# EAGLE design LittleWire_ss (EAGLE 5.11)
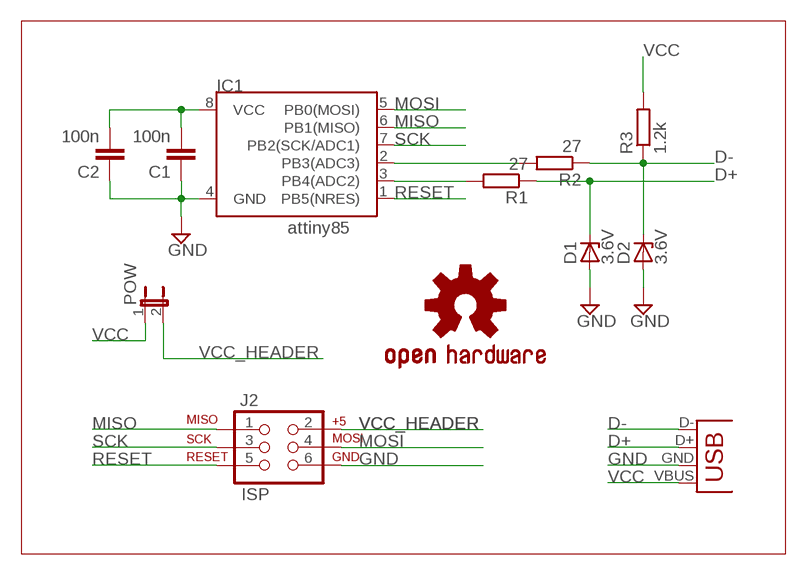
[diagram p0: schematic, sheet 1]

## Parts
C1  100n  C-EU050-025X075  [C050-025X075]
C2  100n  C-EU050-025X075  [C050-025X075]
D1  3.6V  ZENER-DIODEZD-7.5  [ZDIO-7.5]
D2  3.6V  ZENER-DIODEZD-7.5  [ZDIO-7.5]
IC1  ATTINY45DIP8  [DIP08]
J2  ISP  AVR_SPI_PRG_6PTH  [2X3]
POW  JP1E  [JP1]
R1  27  R-EU_0207/7  [0207/7]
R2  27  R-EU_0207/7  [0207/7]
R3  1.2k  R-EU_0207/7  [0207/7]
U$1  OSHW-LOGOS  [OSHW-LOGO-S]
X1  USB-A-H  [USB-A-H]

## Nets
D+: D1.C R1.1 X1.D+(D-)
D-: D2.C R2.1 R3.1 X1.D-(D+)
GND: C1.1 C2.1 D1.A D2.A IC1.4(GND) J2.6 X1.GND(VBUS)
MISO: IC1.6(PB1(MISO)) J2.1
MOSI: IC1.5(PB0(MOSI)) J2.4
N$1: IC1.2(PB3(ADC3)) R2.2
N$2: IC1.3(PB4(ADC2)) R1.2
RESET: IC1.1(PB5(NRES)) J2.5
SCK: IC1.7(PB2(SCK/ADC1)) J2.3
VCC: C1.2 C2.2 IC1.8(VCC) POW.1 R3.2 X1.VBUS(GND)
VCC_HEADER: J2.2 POW.2

## Notes on the sheet
- attiny85

## Library data of the parts
C1 C2 = rcl:C-EU: CAPACITOR, European symbol
D1 D2 = diode:ZENER-DIODE: Z-Diode
IC1 = SparkFun:ATTINY45: Atmel ATTiny45
J2 = SparkFun:AVR_SPI_PRG_6: AVR ISP 6 Pin This is the reduced ISP connector for AVR programming. Common on Arduino. This footprint will take up less PCB space and can be used with a 10-pin to 6-pin adapter such as SKU: BOB-08508
POW = jumper:JP1E: JUMPER
R1-R3 = rcl:R-EU_: RESISTOR, European symbol
U$1 = SparkFun:OSHW-LOGO: Open Source Hardware Logo This logo indicates the piece of hardware it is found on incorporates a OSHW license and/or adheres to the definition of open source hardware found here: http://freedomdefined.org/OSHW
X1 = SparkFun:USB: USB Connectors USB-B-PTH is fully proven SKU : PRT-00139 USB-miniB is fully proven SKU : PRT-00587 USB-A-PCB is untested. USB-A-H is throughly reviewed, but untested. Spark Fun Electronics SKU : PRT-00437 USB-B-SMT is throughly reviewed, but untested. Needs silkscreen touching up. USB-A-S has not been used/tested USB-MB-H has not been used/tested

## Board
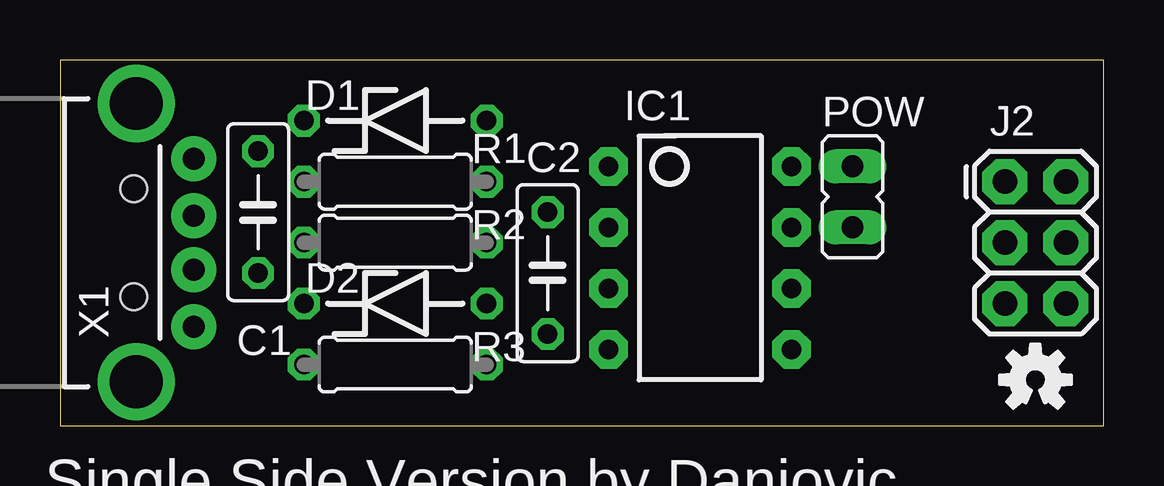
[diagram p1: board, top side]
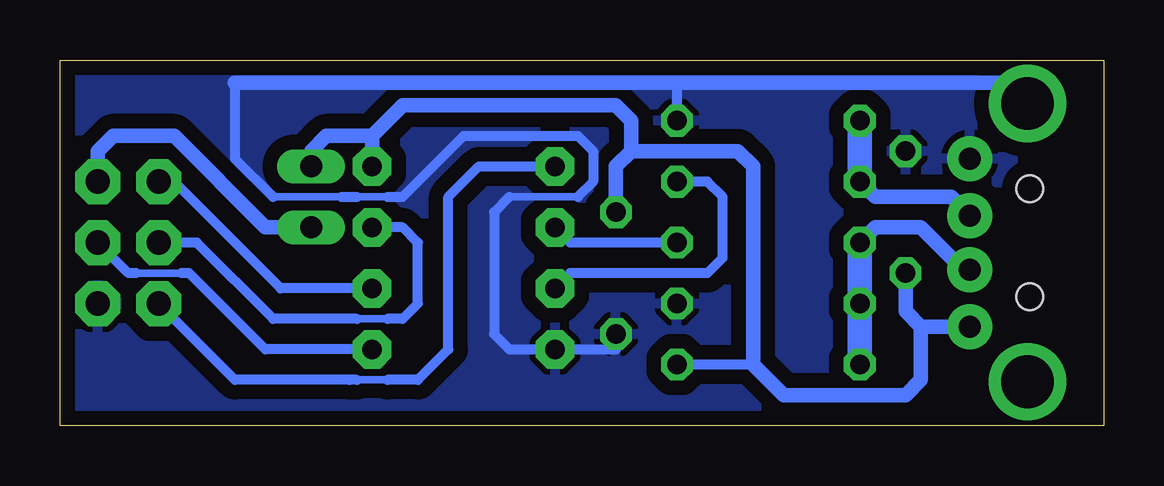
[diagram p2: board, bottom side, seen from below]

Size 43.48 x 15.23 mm. Coordinates in mm from the lower left corner, seen from the top.
Outline: 0,0 43.48,0 43.48,15.23 0,15.23 0,0
Copper layers (1*16): Top 0.035mm / dielectric 1.5mm / Bottom 0.035mm
Design rules "default *": minimum track width 10mil, minimum drill 24mil, track to track 8mil, track to pad 8mil, pad to pad 8mil, via to via 8mil, smd to smd 8mil, copper to edge 16mil, drill to drill 8mil, minimum pad ring 10mil, minimum via ring 8mil, stop-mask expansion 4mil, vias tented up to drill 0mil, thermal gap 10mil

### Footprints (pad centres in the part's own frame; a part is rotated, then mirrored left to right if it is on the bottom)
C050-025X075 = drill 0.813 octagon: 1 -2.54,0; 2 2.54,0
ZDIO-7.5 = drill 0.813 octagon: A 3.81,0; C -3.81,0
DIP08 = drill 0.813 pad 1.6 octagon: 1 -3.81,-3.81; 2 -1.27,-3.81; 3 1.27,-3.81; 4 3.81,-3.81; 5 3.81,3.81; 6 1.27,3.81; 7 -1.27,3.81; 8 -3.81,3.81
2X3 = drill 1.016 pad 1.88 octagon: 1 0,0; 2 0,2.54; 3 2.54,0; 4 2.54,2.54; 5 5.08,0; 6 5.08,2.54
JP1 = drill 0.914 long: 1 0,-1.27; 2 0,1.27
0207/7 = drill 0.813 octagon: 1 -3.81,0; 2 3.81,0
USB-A-H = drill 0.914 pad 1.88 round: D+ 2.4,1.127; D- 2.4,-1.127; GND 2.4,3.5; VBUS 2.4,-3.5 | drill 2.2 round: GND2 0,-5.8; GND3 0,5.8 | hole 1.1: -0.1,2.25; -0.1,-2.25

### Placement (x,y rotation side)
C1  8.26,8.89 270 top
C2  20.32,6.35 90 top
D1  13.97,12.7 0 top
D2  13.97,5.08 0 top
IC1  26.67,6.98 270 top
J2  39.37,10.16 270 top
POW  33.02,9.52 180 top
R1  13.97,10.16 0 top
R2  13.97,7.62 0 top
R3  13.97,2.54 0 top
U$1  40.64,1.9 0 top
X1  3.18,7.62 0 top

### Tracks (layer width: path | path; a pad name or v marks a point on that pad's centre or on a via)
D+
  Bottom 0.61: R1.1 9.53,9.52 6.35,9.52 X1.D+
  Bottom 1.016: R1.1 D1.C
D-
  Bottom 0.61: R2.1 9.53,8.25 7.62,8.25 5.86,6.49 X1.D-
  Bottom 1.016: R2.1 D2.C R3.1
GND
  Bottom 0.305: 21.91,9.52 24.77,9.52 | 31.11,9.52 29.85,9.52 | 34.61,9.52 31.75,9.52
  Bottom 0.406: C2.1 20.32,3.18 IC1.4 24.77,3.18 25.4,3.81 25.4,8.89 24.77,9.52 | 21.91,9.52 21.27,10.16 21.27,11.43 21.91,12.06 26.67,12.06 29.21,9.52 29.85,9.52 | 34.61,9.52 36.19,11.11 36.19,14.29 | 17.78,14.29 D1.A | 31.75,9.52 31.11,9.52
  Bottom 0.61: 36.19,14.29 17.78,14.29 3.18,14.29
  pour Bottom (isolate 0.61): -0.63,16.51 44.45,16.51 44.45,-0.64 -0.63,-0.64
MISO
  Bottom 0.406: J2.1 38.73,10.16 34.29,5.71 IC1.6
MOSI
  Bottom 0.305: 38.42,6.35 40.32,6.35
  Bottom 0.406: J2.4 40.64,6.35 40.32,6.35 | IC1.5 34.92,3.18 38.1,6.35 38.42,6.35
N$1
  Bottom 0.406: R2.2 22.23,7.62 IC1.2
N$2
  Bottom 0.406: R1.2 16.51,10.16 15.88,9.52 15.88,6.98 16.51,6.35 22.23,6.35 IC1.3
RESET
  Bottom 0.305: 29.85,1.9 31.11,1.9
  Bottom 0.406: J2.5 36.19,1.9 31.43,1.9 31.11,1.9 | IC1.1 26.04,10.79 27.31,9.52 27.31,3.18 28.57,1.9 29.85,1.9
SCK
  Bottom 0.305: 29.85,4.45 31.11,4.45
  Bottom 0.406: J2.3 37.78,7.62 34.61,4.45 31.11,4.45 | IC1.7 29.21,8.25 28.57,7.62 28.57,5.08 29.21,4.45 29.85,4.45
VCC
  Bottom 0.406: 14.61,2.54 R3.2
  Bottom 0.61: X1.VBUS 7.62,4.12 | 7.62,4.12 7.62,1.9 8.26,1.27 13.34,1.27 14.61,2.54 14.61,10.79 15.24,11.43 19.68,11.43 | 30.48,12.06 IC1.8 | 30.48,12.06 29.21,13.33 20.32,13.33 19.68,12.7 19.68,11.43 | 19.68,11.43 20.32,10.79 C2.2 | POW.1 33.02,11.43 32.39,12.06 30.48,12.06 | 7.62,4.12 8.26,4.75 C1.2
VCC_HEADER
  Bottom 0.61: POW.2 34.92,8.25 38.73,12.06 41.28,12.06 41.91,11.43 J2.2

### Text on the board
tPlace: Single Side Version by Danjovic | danjovic@hotmail.com